# Altium schematic sheet Arduino.SchDoc
size A
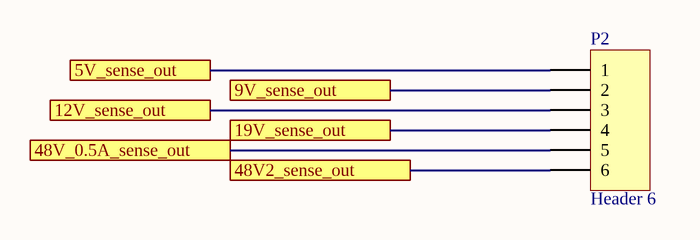
[diagram p0: Arduino.SchDoc]

## Parts
P2  Header 6  [HDR1X6]

## Ports
5V_sense_out, 9V_sense_out, 12V_sense_out, 19V_sense_out, 48V2_sense_out, 48V_0.5A_sense_out

## Nets
5V_sense_out: P2.1 ; port 5V_sense_out
9V_sense_out: P2.2 ; port 9V_sense_out
12V_sense_out: P2.3 ; port 12V_sense_out
19V_sense_out: P2.4 ; port 19V_sense_out
48V2_sense_out: P2.6 ; port 48V2_sense_out
48V_0.5A_sense_out: P2.5 ; port 48V_0.5A_sense_out

## Library data of the parts
P2 = Header 6: Header, 6-Pin; LatestRevisionDate: 17-Jul-2002; LatestRevisionNote: Re-released for DXP Platform.; Publisher: Altium Limited